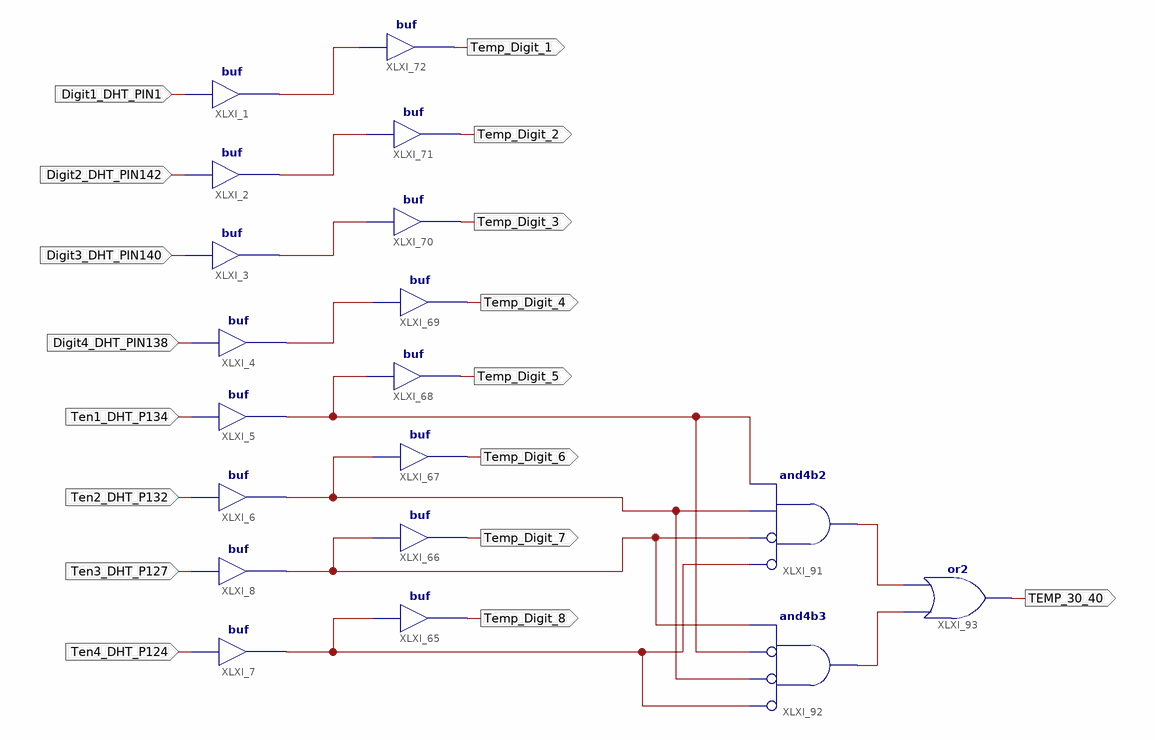
[diagram p0: schematic sheet 1]
// Xilinx ISE schematic TempCheck_Living.sch (spartan6) as structural Verilog: 19 symbols, 17 ports
module TempCheck_Living (
  input  Digit1_DHT_PIN1,
  input  Digit2_DHT_PIN142,
  input  Digit3_DHT_PIN140,
  input  Digit4_DHT_PIN138,
  input  Ten1_DHT_P134,
  input  Ten2_DHT_P132,
  input  Ten3_DHT_P127,
  input  Ten4_DHT_P124,
  output Temp_Digit_1,
  output Temp_Digit_2,
  output Temp_Digit_3,
  output Temp_Digit_4,
  output Temp_Digit_5,
  output Temp_Digit_6,
  output Temp_Digit_7,
  output Temp_Digit_8,
  output TEMP_30_40
);

  wire XLXN_1, XLXN_2, XLXN_3, XLXN_4, XLXN_49, XLXN_50, XLXN_51, XLXN_52, XLXN_53, XLXN_54;

  buf XLXI_1 (XLXN_1, Digit1_DHT_PIN1);
  buf XLXI_2 (XLXN_2, Digit2_DHT_PIN142);
  buf XLXI_3 (XLXN_3, Digit3_DHT_PIN140);
  buf XLXI_4 (XLXN_4, Digit4_DHT_PIN138);
  buf XLXI_5 (XLXN_50, Ten1_DHT_P134);
  buf XLXI_6 (XLXN_51, Ten2_DHT_P132);
  buf XLXI_7 (XLXN_52, Ten4_DHT_P124);
  buf XLXI_8 (XLXN_49, Ten3_DHT_P127);
  buf XLXI_65 (Temp_Digit_8, XLXN_52);
  buf XLXI_66 (Temp_Digit_7, XLXN_49);
  buf XLXI_67 (Temp_Digit_6, XLXN_51);
  buf XLXI_68 (Temp_Digit_5, XLXN_50);
  buf XLXI_69 (Temp_Digit_4, XLXN_4);
  buf XLXI_70 (Temp_Digit_3, XLXN_3);
  buf XLXI_71 (Temp_Digit_2, XLXN_2);
  buf XLXI_72 (Temp_Digit_1, XLXN_1);
  and XLXI_91 (XLXN_53, ~XLXN_52, ~XLXN_49, XLXN_51, XLXN_50);  // and4b2
  and XLXI_92 (XLXN_54, ~XLXN_52, ~XLXN_51, ~XLXN_50, XLXN_49);  // and4b3
  or XLXI_93 (TEMP_30_40, XLXN_54, XLXN_53);
endmodule
